# Altium schematic sheet rf_swrmet6.SchDoc: mcHF QRP Transceiver RF board
size A4; Author: K Atanassov; CompanyName: M0NKA; Revision: 0.6.3; SheetTotal: 12
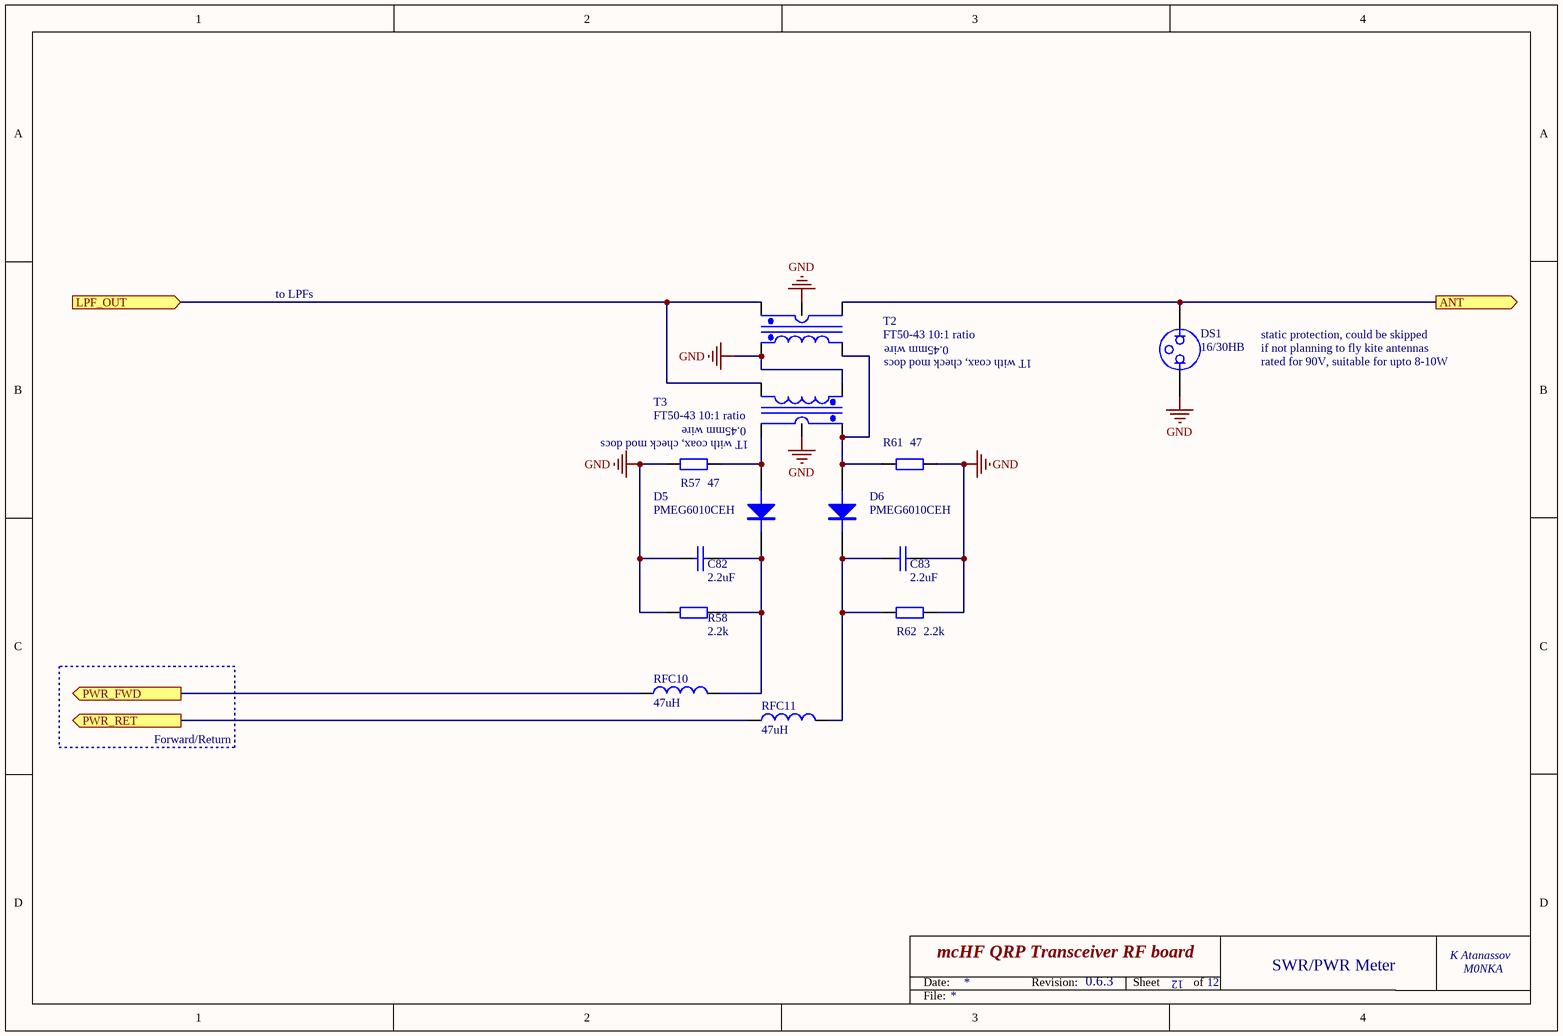
[diagram p0: rf_swrmet6.SchDoc]

## Parts
C82  2.2uF  [0805-Pro]
C83  2.2uF  [0805-Pro]
D5  PMEG6010CEH  [SOD87]
D6  PMEG6010CEH  [SOD87]
DS1  16/30HB  [SIP2]
R57  47  [0805-Pro]
R58  2.2k  [0805-Pro]
R61  47  [0805-Pro]
R62  2.2k  [0805-Pro]
RFC10  47uH  [0805-Pro]
RFC11  47uH  [0805-Pro]
T2  FT50-43 10:1 ratio  [SWR_TR _new]
T3  FT50-43 10:1 ratio  [SWR_TR _new]

## Ports
ANT (out), LPF_OUT (in), PWR_FWD (out), PWR_RET (out)

## Nets
GND: C82.1 C83.2 DS1.1 R57.1 R58.1 R61.2 R62.2 T2.1(Pri+) T2.5(Shield) T3.1(Pri+) T3.5(Shield)
ANT: DS1.2 T2.4(Sec-) ; port ANT
LPF_OUT: T2.3(Sec+) T3.2(Pri-) ; port LPF_OUT
PWR_FWD: RFC10.1 ; port PWR_FWD
PWR_RET: RFC11.1 ; port PWR_RET
NetC82_2: C82.2 D5.2(K) R58.2 RFC10.2
NetC83_1: C83.1 D6.2(K) R62.1 RFC11.2
NetD5_1: D5.1(A) R57.2 T3.4(Sec-)
NetD6_1: D6.1(A) R61.1 T2.2(Pri-) T3.3(Sec+)

## Notes on the sheet
- to LPFs
- 0.45mm wire
- 1T with coax, check mod docs
- static protection, could be skipped
- if not planning to fly kite antennas
- rated for 90V, suitable for upto 8-10W
- (near T3) 0.45mm wire
- Forward/Return
- 12
- SWR/PWR Meter
- Date:
- Revision:
- Sheet
- of
- File:

## Library data of the parts
C82 C83 = CAP: Capacitor; Order: FN 184-5751; QT Order: QCC-00103; Price: 0.115
D5 D6 = PMEG6010CEH: DIODE, SCHOTTKY, 1A, 60V, SOD-123F; Order: FN 151-0694; QT Order: QCD-00034; Price: 0.085
DS1 = 16/30HB: NEON LAMP, WIRE ENDED, T2; Order: FN 113-9250; Price: 0.243
R57 R61 = RES: Resistor; Order: FN 173-8942; QT Order: QCR-00293; Price: 0.052
R58 R62 = RES: Resistor; Order: FN 188-7289; QT Order: QCR-00333; Price: 0.046
RFC10 RFC11 = TDK-NLV25T: INDUCTOR, SIGNAL LINE, 4.7UH, 1005; Order: FN 166-9895; Price: 0.166
T2 T3 = SWR_TR: SWR Bridge transformer; Order: EB 300771069431; Price: 0.795